# EAGLE design ICE_mod_hbridge (EAGLE 5.06)
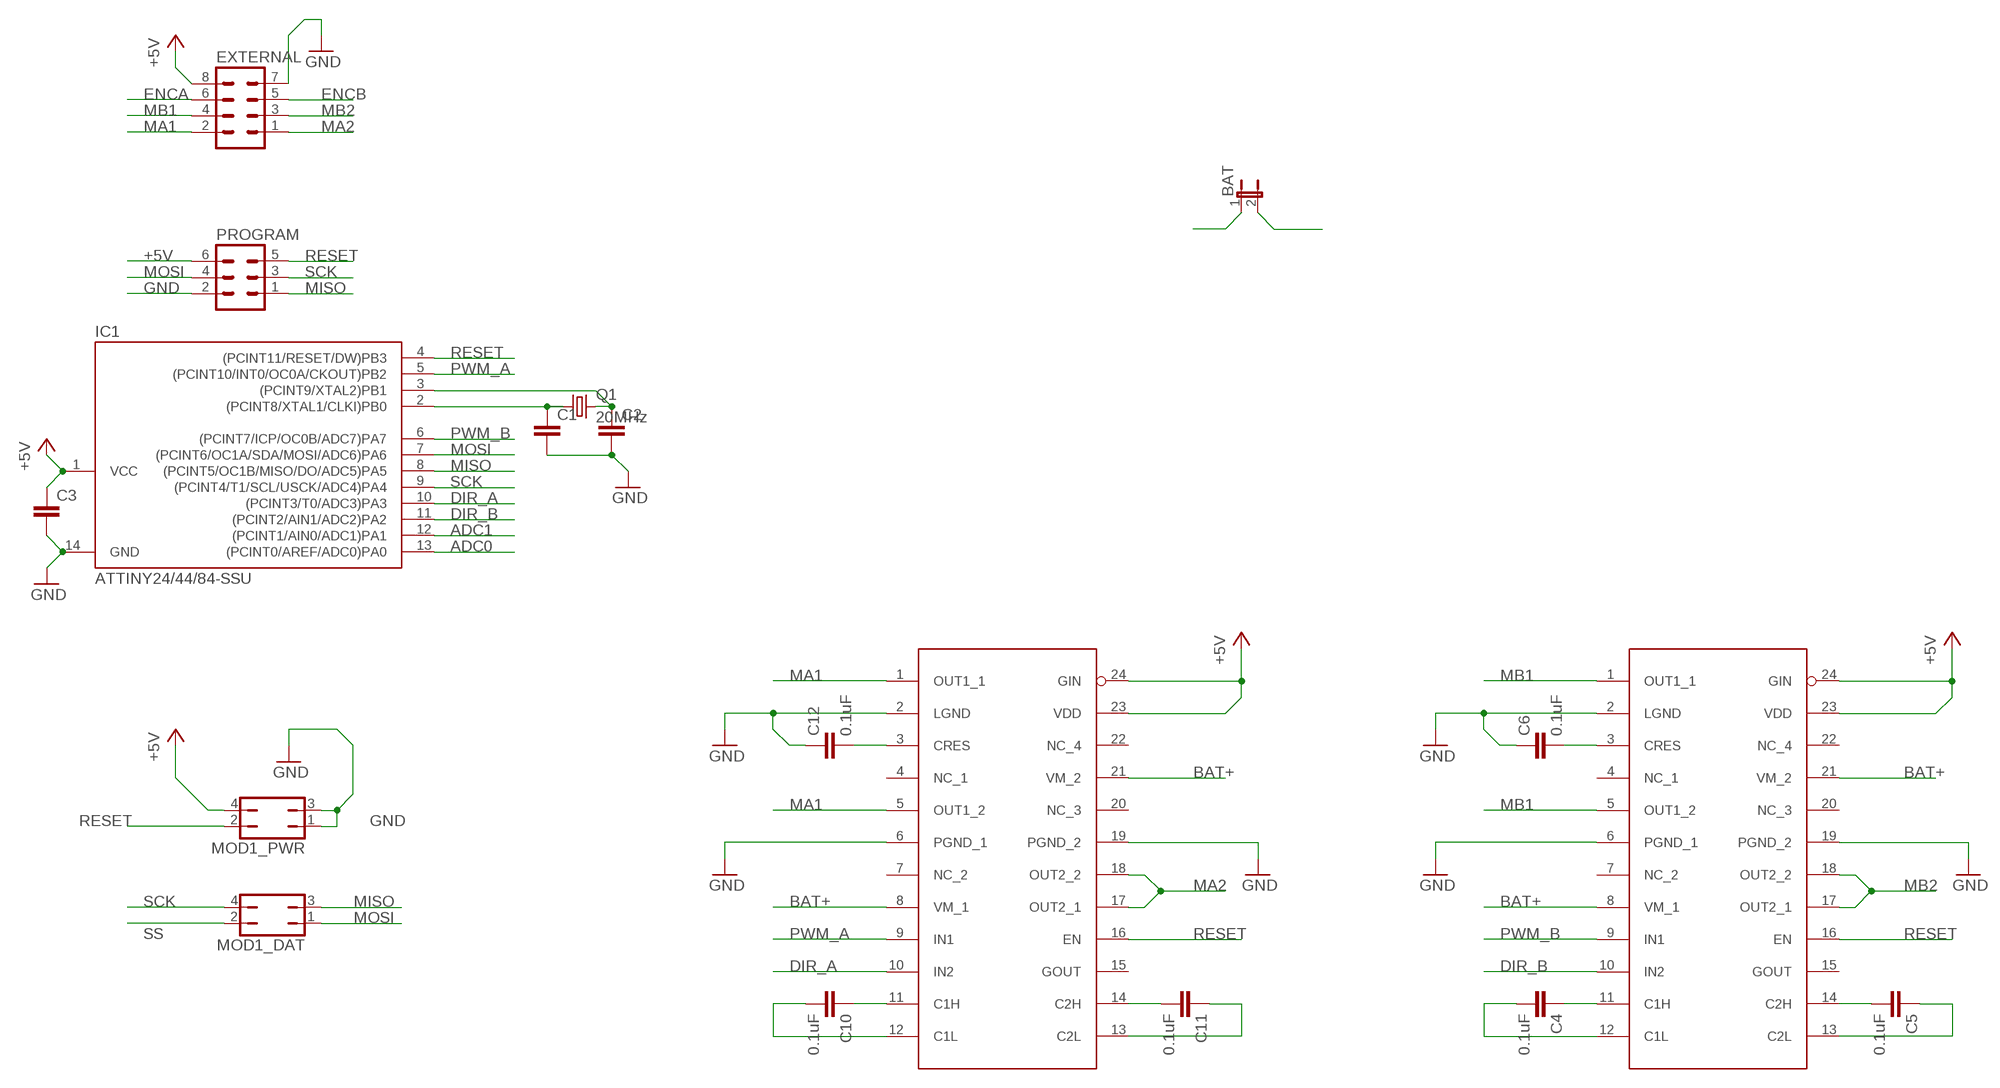
[diagram p0: schematic, sheet 1]

## Parts
BAT  JP1E  [JP1]
C1  C-EUC0805K  [C0805K]
C2  C-EUC0805K  [C0805K]
C3  C-EUC0805K  [C0805K]
C4  0.1uF  C-EUC0805K  [C0805K]
C5  0.1uF  C-EUC0805K  [C0805K]
C6  0.1uF  C-EUC0805K  [C0805K]
C10  0.1uF  C-EUC0805K  [C0805K]
C11  0.1uF  C-EUC0805K  [C0805K]
C12  0.1uF  C-EUC0805K  [C0805K]
EXTERNAL  MA04-2  [MA04-2]
IC1  ATTINY24/44/84-SSU  [SOIC14]
MOD1_DAT  JP2Q  [JP2Q]
MOD1_PWR  JP2Q  [JP2Q]
PROGRAM  MA03-2  [MA03-2]
Q1  20MHz  CRYSTALHC49S  [HC49/S]
U$1  MPC17510  [TSSOP24]
U$3  MPC17510  [TSSOP24]

## Nets
+5V: C3.1 EXTERNAL.8 IC1.1(VCC) MOD1_PWR.4 PROGRAM.6 U$1.23(VDD) U$1.24(GIN) U$3.23(VDD) U$3.24(GIN)
ADC0: IC1.13((PCINT0/AREF/ADC0)PA0)
ADC1: IC1.12((PCINT1/AIN0/ADC1)PA1)
BAT+: BAT.1 U$1.8(VM_1) U$1.21(VM_2) U$3.8(VM_1) U$3.21(VM_2)
DIR_A: IC1.10((PCINT3/T0/ADC3)PA3) U$3.10(IN2)
DIR_B: IC1.11((PCINT2/AIN1/ADC2)PA2) U$1.10(IN2)
ENCA: EXTERNAL.6
ENCB: EXTERNAL.5
GND: BAT.2 C1.2 C2.2 C3.2 C6.1 C12.1 EXTERNAL.7 IC1.14(GND) MOD1_PWR.1 MOD1_PWR.3 PROGRAM.2 U$1.2(LGND) U$1.6(PGND_1) U$1.19(PGND_2) U$3.2(LGND) U$3.6(PGND_1) U$3.19(PGND_2)
MA1: EXTERNAL.2 U$3.1(OUT1_1) U$3.5(OUT1_2)
MA2: EXTERNAL.1 U$3.17(OUT2_1) U$3.18(OUT2_2)
MB1: EXTERNAL.4 U$1.1(OUT1_1) U$1.5(OUT1_2)
MB2: EXTERNAL.3 U$1.17(OUT2_1) U$1.18(OUT2_2)
MISO: IC1.8((PCINT5/OC1B/MISO/DO/ADC5)PA5) MOD1_DAT.3 PROGRAM.1
MOSI: IC1.7((PCINT6/OC1A/SDA/MOSI/ADC6)PA6) MOD1_DAT.1 PROGRAM.4
N$1: C2.1 IC1.3((PCINT9/XTAL2)PB1) Q1.2
N$2: C1.1 IC1.2((PCINT8/XTAL1/CLKI)PB0) Q1.1
N$3: C10.1 U$3.11(C1H)
N$4: C10.2 U$3.12(C1L)
N$5: C11.2 U$3.14(C2H)
N$6: C11.1 U$3.13(C2L)
N$7: C4.1 U$1.11(C1H)
N$8: C12.2 U$3.3(CRES)
N$9: C4.2 U$1.12(C1L)
N$10: C5.2 U$1.14(C2H)
N$11: C5.1 U$1.13(C2L)
N$12: C6.2 U$1.3(CRES)
PWM_A: IC1.5((PCINT10/INT0/OC0A/CKOUT)PB2) U$3.9(IN1)
PWM_B: IC1.6((PCINT7/ICP/OC0B/ADC7)PA7) U$1.9(IN1)
RESET: IC1.4((PCINT11/RESET/DW)PB3) MOD1_PWR.2 PROGRAM.5 U$1.16(EN) U$3.16(EN)
SCK: IC1.9((PCINT4/T1/SCL/USCK/ADC4)PA4) MOD1_DAT.4 PROGRAM.3
SS: MOD1_DAT.2
Unconnected: U$1.4(NC_1) U$1.7(NC_2) U$1.15(GOUT) U$1.20(NC_3) U$1.22(NC_4) U$3.4(NC_1) U$3.7(NC_2) U$3.15(GOUT) U$3.20(NC_3) U$3.22(NC_4)

## Library data of the parts
BAT = jumper:JP1E: JUMPER
C1-C6 C10-C12 = rcl:C-EU: CAPACITOR, European symbol
EXTERNAL = con-lstb:MA04-2: PIN HEADER
IC1 = attiny24_44_84:ATTINY24/44/84
MOD1_DAT MOD1_PWR = jumper:JP2Q: JUMPER
PROGRAM = con-lstb:MA03-2: PIN HEADER
Q1 = crystal:CRYSTAL: CRYSTAL
U$1 U$3 = mpc17510:MPC17510

## Board
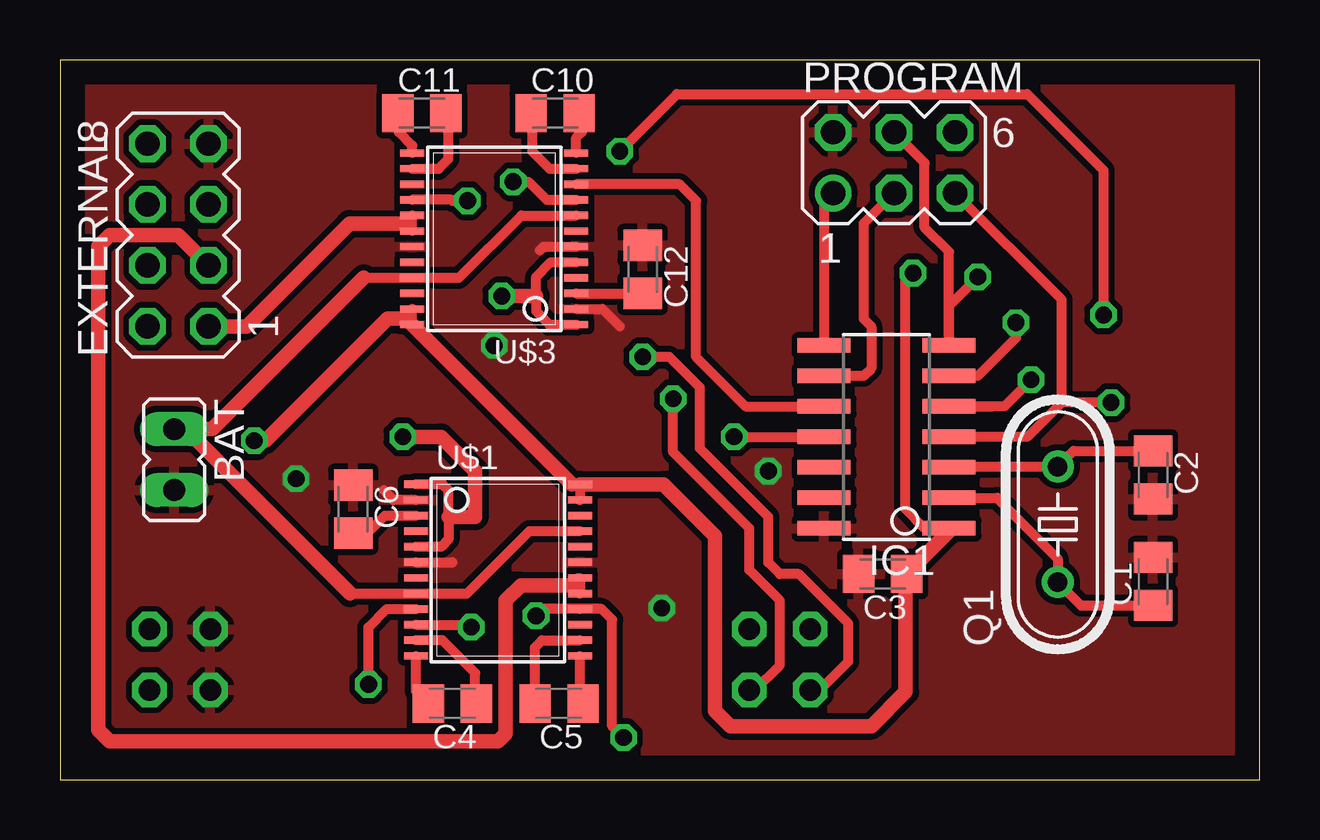
[diagram p1: board, top side]
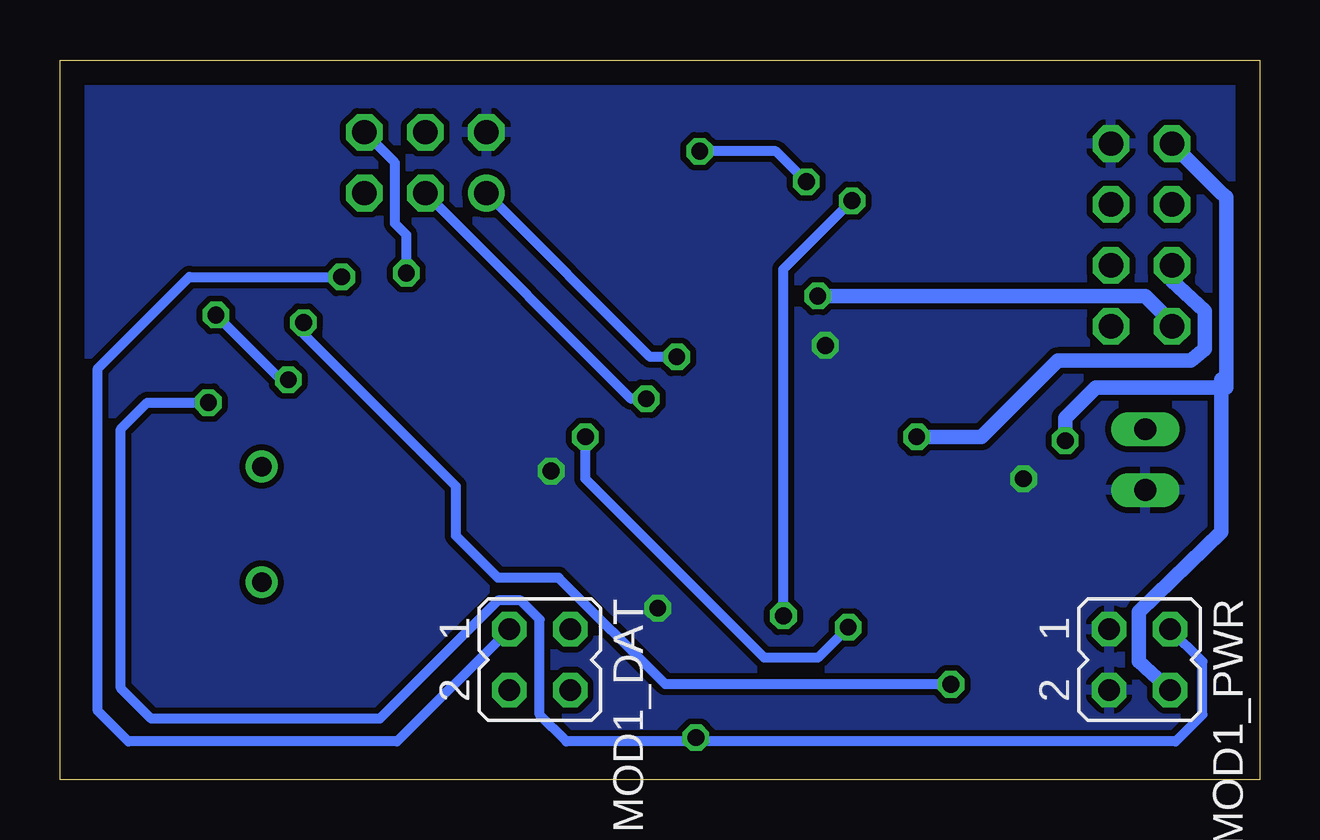
[diagram p2: board, bottom side, seen from below]

Size 50 x 30 mm. Coordinates in mm from the lower left corner, seen from the top.
Outline: 0,0 50,0 50,30 0,30 0,0
Copper layers (1*16): Top 0.035mm / dielectric 1.5mm / Bottom 0.035mm
Design rules "olimex-8mils": minimum track width 8mil, minimum drill 0.6mm, track to track 8mil, track to pad 8mil, pad to pad 8mil, via to via 8mil, smd to smd 8mil, copper to edge 40mil, drill to drill 10mil, minimum pad ring 10mil, minimum via ring 8mil, stop-mask expansion 0mil, vias tented up to drill 0mil, thermal gap 10mil

### Footprints (pad centres in the part's own frame; a part is rotated, then mirrored left to right if it is on the bottom)
JP1 = drill 0.914 long: 1 0,-1.27; 2 0,1.27
C0805K = smd 1.3 x 1.6: 1 -1,0; 2 1,0
MA04-2 = drill 1.016 octagon: 1 -3.81,-1.27; 2 -3.81,1.27; 3 -1.27,-1.27; 4 -1.27,1.27; 5 1.27,-1.27; 6 1.27,1.27; 7 3.81,-1.27; 8 3.81,1.27
SOIC14 = smd 0.61 x 2.21: 1 -3.81,-2.603; 2 -2.54,-2.603; 3 -1.27,-2.603; 4 0,-2.603; 5 1.27,-2.603; 6 2.54,-2.603; 7 3.81,-2.603; 8 3.81,2.603; 9 2.54,2.603; 10 1.27,2.603; 11 0,2.603; 12 -1.27,2.603; 13 -2.54,2.603; 14 -3.81,2.603
JP2Q = drill 0.914 octagon: 1 -1.27,-1.27; 2 -1.27,1.27; 3 1.27,-1.27; 4 1.27,1.27
MA03-2 = drill 1.016 round: 1 -2.54,-1.27 | drill 1.016 octagon: 2 -2.54,1.27; 3 0,-1.27; 4 0,1.27; 5 2.54,-1.27; 6 2.54,1.27
HC49/S = drill 0.813 round: 1 -2.413,0; 2 2.413,0
TSSOP24 = smd 0.305 x 0.991: 1 -3.575,-3.418; 2 -2.925,-3.418; 3 -2.275,-3.418; 4 -1.625,-3.418; 5 -0.975,-3.418; 6 -0.325,-3.418; 7 0.325,-3.418; 8 0.975,-3.418; 9 1.625,-3.418; 10 2.275,-3.418; 11 2.925,-3.418; 12 3.575,-3.418; 13 3.575,3.418; 14 2.925,3.418; 15 2.275,3.418; 16 1.625,3.418; 17 0.975,3.418; 18 0.325,3.418; 19 -0.325,3.418; 20 -0.975,3.418; 21 -1.625,3.418; 22 -2.275,3.418; 23 -2.925,3.418; 24 -3.575,3.418

### Placement (x,y rotation side)
BAT  4.76,13.34 180 top
C1  45.56,8.26 90 top
C2  45.56,12.7 270 top
C3  34.29,8.57 180 top
C4  16.35,3.17 180 top
C5  20.8,3.17 180 top
C6  12.22,11.27 270 top
C10  20.64,27.78 0 top
C11  15.08,27.78 0 top
C12  24.29,21.27 270 top
EXTERNAL  4.92,22.7 90 top
IC1  34.45,14.29 90 top
MOD1_DAT  30,5 270 bottom
MOD1_PWR  5,5 270 bottom
PROGRAM  34.77,25.72 0 top
Q1  41.59,10.64 90 top
U$1  18.26,8.73 270 top
U$3  18.1,22.54 90 top

### Tracks (layer width: path | path; a pad name or v marks a point on that pad's centre or on a via)
+5V  (via drill 0.7)
  Top 0.406: 37.05,10.34 IC1.1 36.04,10.48 35.24,11.27 35.24,20.8 v35.56,21.11 | 21.34,12.31 U$1.24 U$1.23 | U$3.23 U$3.24 14.44,19.21 14.29,19.21
  Top 0.61: 37.05,10.34 C3.1 35.24,8.53 35.24,3.65 33.81,2.22 27.94,2.22 27.3,2.86 27.3,10.16 25.16,12.31 U$1.24 | U$3.24 21.34,12.31 | v8.1,14.13 8.57,14.13 13.65,19.21 14.29,19.21
  Bottom 0.406: v35.56,21.11 35.56,22.7 36.04,23.18 36.04,25.72 PROGRAM.6
  Bottom 0.61: 1.59,16.19 1.59,16.67 | 1.59,24.45 EXTERNAL.8 | 1.59,24.45 | 1.59,24.45 1.38,24.29 1.38,16.35 1.59,16.19 | v8.1,14.13 8.1,15.08 6.83,16.35 1.75,16.35 1.59,16.19 | 1.59,16.19 1.59,10.32 5.02,6.99 5.02,4.92 MOD1_PWR.4
BAT+
  Top 0.406: U$3.8 19.23,23.52 16.63,20.92 U$3.21 12.66,20.92 | BAT.1 5.24,14.61 | 12.09,7.76 U$1.8 16.96,7.76 19.29,10.08 19.56,10.36 U$1.21
  Top 0.61: 12.66,20.92 6.35,14.61 BAT.1 | 5.24,14.61 12.09,7.76
DIR_A
  Top 0.406: U$3.10 25.82,24.82 26.51,24.13 26.51,17.62 28.57,15.56 IC1.10 | IC1.10
DIR_B  (via drill 0.7)
  Top 0.406: v28.1,14.29 IC1.11 | v28.1,14.29 | U$1.10 17.04,6.46 v17.14,6.35
  Bottom 0.406: v28.1,14.29 28.1,12.54 20.64,5.08 18.41,5.08 v17.14,6.35
GND  (via drill 0.7)
  Top 0.406: U$1.2 13.9,11.66 13.49,12.06 | U$1.6 16.34,9.06 16.35,9.05 | U$3.6 20.15,22.22 20,22.07 | 22.61,19.62 U$3.2 22.61,19.62 | 22.61,19.62 23.34,18.89
  other vias: 29.53,12.86 9.84,12.54 25.08,7.14 18.1,18.1
  pour Bottom (isolate 0.254): -0.16,0.32 0,0.32 0,30.32 49.85,30.32 49.85,29.84 50.01,29.84 50.01,-0.16
  pour Top (isolate 0.254): 0.16,-0.16 0.16,29.84 49.85,29.84 49.85,0.16
MA1  (via drill 0.7)
  Top 0.406: U$3.1 20.4,18.97 19.84,19.53 19.84,20.16 19.84,20.95 20.46,21.57 U$3.5
  Top 0.61: v18.41,20.16 19.84,20.16
  Bottom 0.61: EXTERNAL.2 3.65,19.05 4.76,20.16 v18.41,20.16
MA2
  Top 0.406: 14.34,23.18 U$3.17 U$3.18 14.37,23.18
  Top 0.61: EXTERNAL.1 7.78,18.89 12.06,23.18 14.37,23.18
MB1  (via drill 0.7)
  Top 0.406: U$1.1 15.95,12.31 16.19,12.06 16.19,10.95 16.19,10 15.9,9.71 U$1.5
  Top 0.61: v14.29,14.29 15.88,14.29 17.3,12.86 17.3,10.95 16.19,10.95
  Bottom 0.61: v14.29,14.29 11.59,14.29 8.41,17.46 2.86,17.46 2.28,17.94 2.28,19.53 3.65,20.8 EXTERNAL.4
MB2
  Top 0.406: U$1.17 U$1.18 21.58,8.41 21.27,8.1
  Top 0.61: EXTERNAL.3 4.92,22.7 2.06,22.7 1.59,22.23 1.59,2.06 2.06,1.59 18.26,1.59 18.57,1.91 18.57,7.46 19.21,8.1 21.27,8.1
MISO  (via drill 0.7)
  Top 0.406: IC1.8 31.84,24.07 PROGRAM.1 | MOD1_DAT.3 31.67,3.73 32.86,4.92 32.86,6.51 30.8,8.57 30,8.57 29.53,9.05 29.53,10.95 26.67,13.81 26.67,16.35 25.4,17.62 v24.29,17.62
  Bottom 0.406: v24.29,17.62 25.4,17.62 PROGRAM.1
MOSI  (via drill 0.7)
  Top 0.406: PROGRAM.4 36.04,25.72 36.04,23.02 37.05,22 IC1.7 37.05,19.75 v38.26,20.95
  Bottom 0.406: v38.26,20.95 44.61,20.95 48.42,17.14 48.42,2.86 47.15,1.59 35.95,1.59 MOD1_DAT.1
N$1
  Top 0.406: IC1.3 37.08,13.05 Q1.2 42.24,13.7 C2.1
N$2
  Top 0.406: IC1.2 39.05,11.75 41.59,9.21 Q1.1 42.56,7.25 C1.1
N$3
  Top 0.406: U$3.11 20.41,25.47 19.68,26.19 19.68,27.73 C10.1
N$4
  Top 0.406: U$3.12 21.52,26.75 21.75,26.99 21.75,27.67 C10.2
N$5
  Top 0.406: U$3.14 15.78,25.47 16.19,25.88 16.19,27.67 C11.2
N$6
  Top 0.406: U$3.13 14.68,26.44 14.13,26.99 14.13,27.73 C11.1
N$7
  Top 0.406: C4.1 17.3,3.22 17.3,4.45 15.94,5.81 U$1.11
N$8
  Top 0.406: U$3.3 23.97,20.27 C12.2
N$9
  Top 0.406: U$1.12 14.84,3.69 C4.2
N$10
  Top 0.406: C5.2 19.8,5.51 20.09,5.81 U$1.14
N$11
  Top 0.406: U$1.13 21.67,3.3 C5.1
N$12
  Top 0.406: U$1.3 13.55,11.01 12.86,10.32 12.27,10.32 C6.2
PWM_A  (via drill 0.7)
  Top 0.406: 38.89,15.56 IC1.5 39.37,15.56 v40.48,16.67 | v43.5,19.37 43.5,25.4 40.32,28.57 25.72,28.57 v23.34,26.19 | v18.89,24.92 19.53,24.92 20.28,24.17 U$3.9
  Bottom 0.406: v40.48,16.67 40.8,16.67 v43.5,19.37 | v23.34,26.19 20.16,26.19 v18.89,24.92
PWM_B  (via drill 0.7)
  Top 0.406: U$1.9 13.62,7.11 12.86,6.35 v12.86,3.97 | IC1.6 38.26,16.83 39.85,18.41 v39.85,19.05
  Bottom 0.406: v12.86,3.97 24.77,3.97 29.21,8.41 31.75,8.41 33.5,10.16 33.5,12.22 39.85,18.57 v39.85,19.05
RESET  (via drill 0.7)
  Top 0.406: v23.5,1.75 23.02,2.22 23.02,6.67 22.58,7.11 U$1.16 20.12,7.11 v19.84,6.83 | v16.99,24.13 16.35,24.13 16.31,24.17 U$3.16 | 41.75,15.72 41.75,20 PROGRAM.5 | IC1.4 40.32,14.29 41.75,15.72 | v43.81,15.72 41.75,15.72
  Bottom 0.406: MOD1_PWR.2 2.38,4.92 2.38,2.7 3.49,1.59 23.34,1.59 v23.5,1.75 23.65,1.59 28.89,1.59 30,2.7 30,6.67 30.8,7.46 31.75,7.46 36.67,2.54 46.2,2.54 47.47,3.81 47.47,14.61 46.35,15.72 v43.81,15.72 | v19.84,6.83 19.84,21.27 v16.99,24.13
SCK  (via drill 0.7)
  Top 0.406: PROGRAM.3 33.5,23.18 33.5,19.21 33.81,18.89 33.81,17.14 33.5,16.83 IC1.9 | MOD1_DAT.4 28.97,3.73 30,4.76 30,7.46 28.73,8.73 28.73,10.48 25.56,13.65 v25.56,15.88
  Bottom 0.406: v25.56,15.88 26.19,15.88 PROGRAM.3